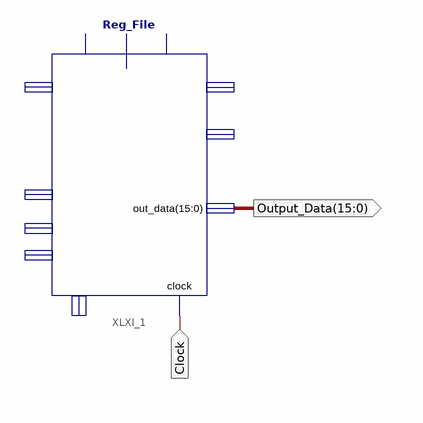
[diagram p0: schematic sheet 1]
// Xilinx ISE schematic test.sch (spartan3e) as structural Verilog: 1 symbols, 2 ports
module test (
  input  Clock,
  output [15:0] Output_Data
);

  Reg_File XLXI_1 (
    .out_data(Output_Data), .clock(Clock));  // open: write_data, reg_write, iszero_write, in_data_write, acc_data, ra, read_data, wa, in_data, iszero_data
endmodule
